# Altium project Power Distribution Board.PrjPcb
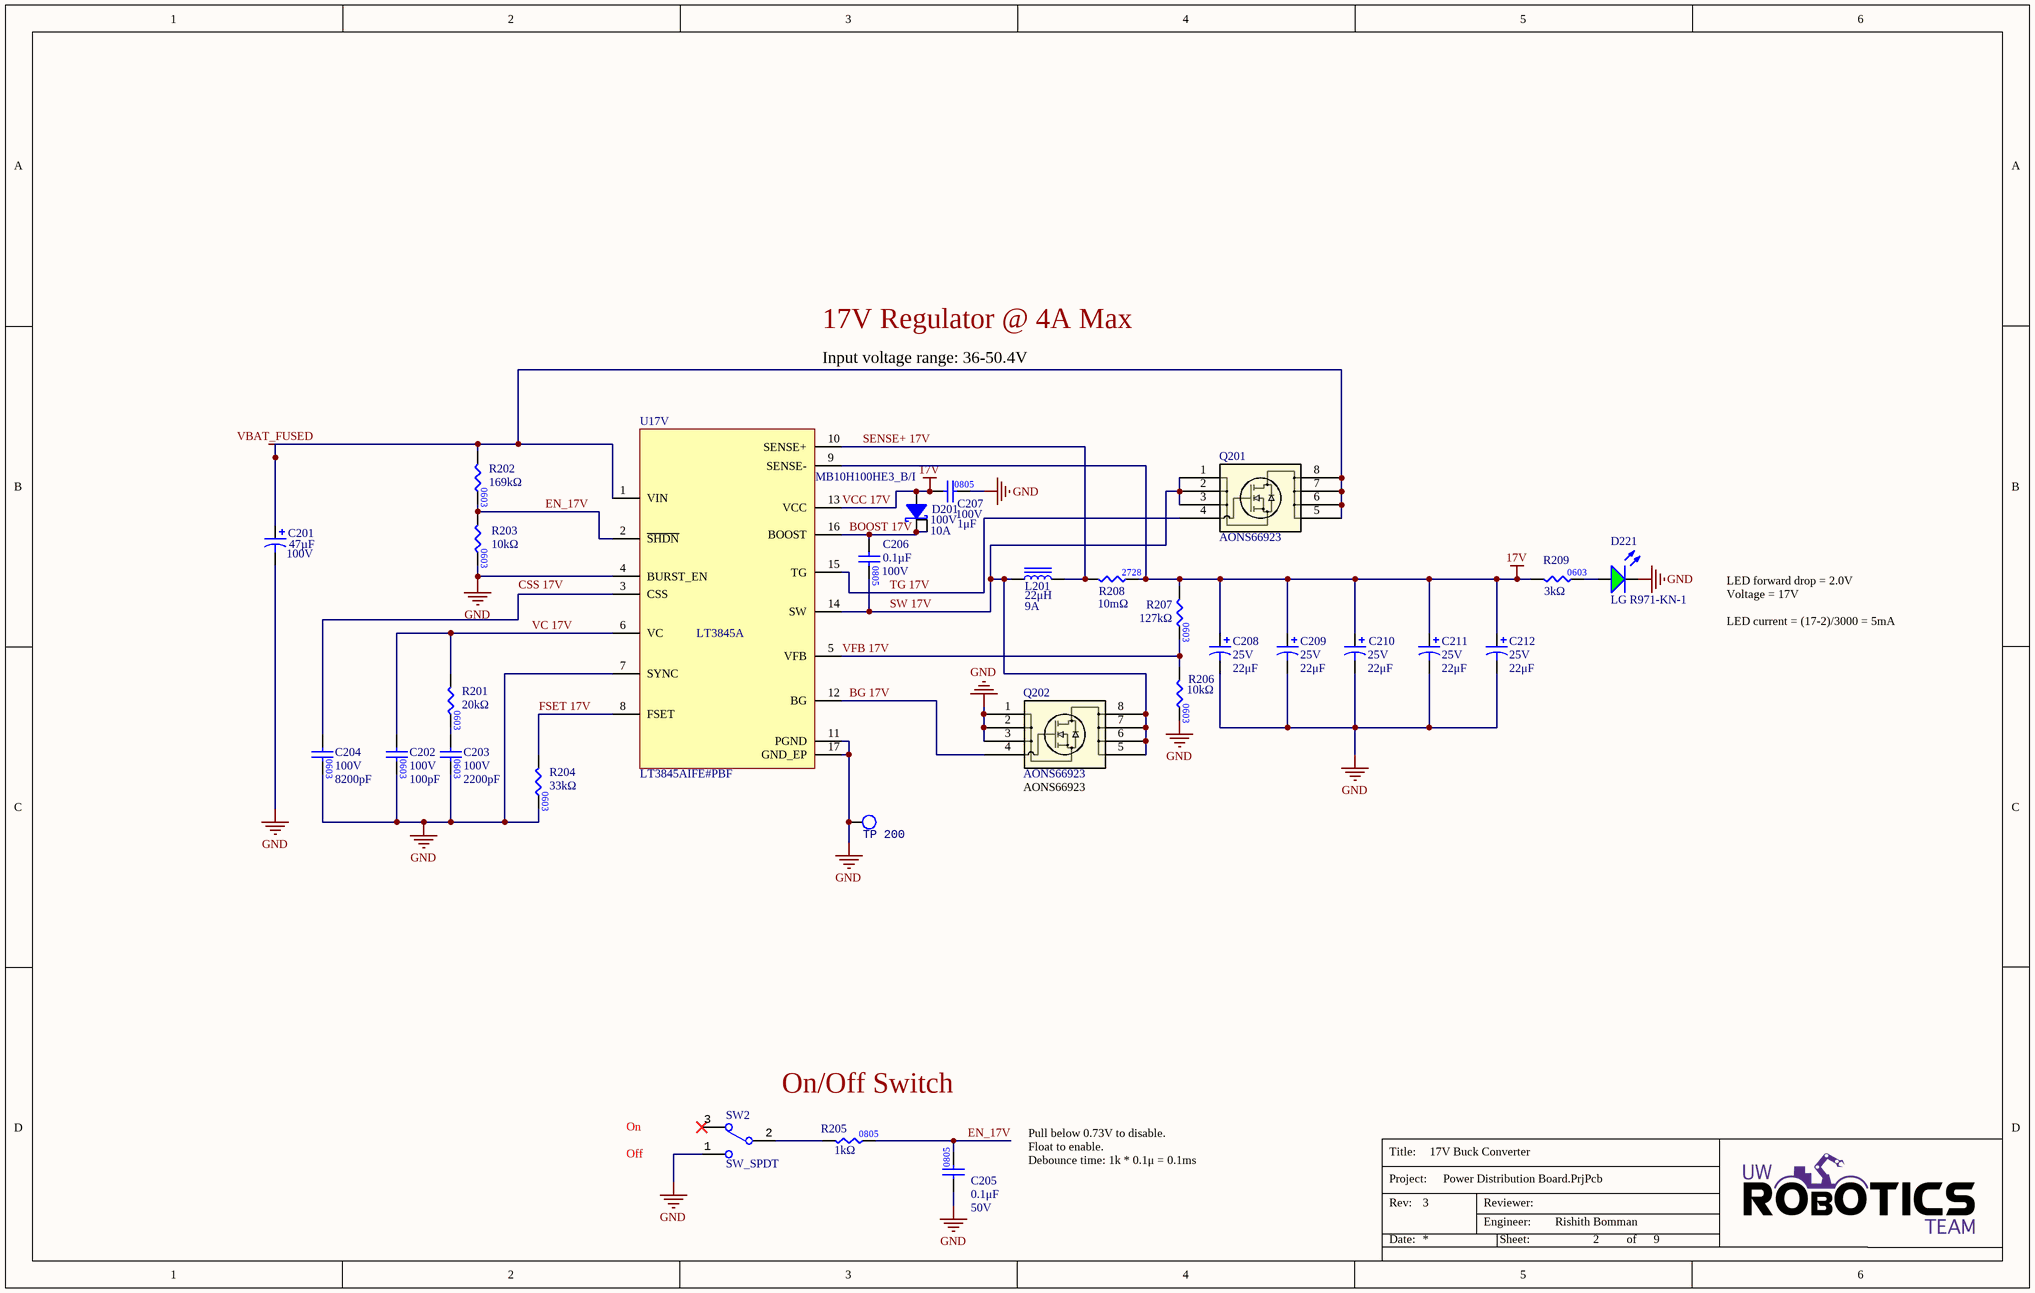
[diagram p0: SH2 - 17V BUCK CONVERTER.SchDoc]
3 sheets, 81 parts. Net scope: flat (ports and power ports of the same name join across sheets).
Board file: Power Distribution Board.PcbDoc
Sheets:
  SH2 - 17V BUCK CONVERTER.SchDoc
  SH7 - MICROCONTROLLER.SchDoc
  SH9 - RS-485.SchDoc

## Sheet SH2 - 17V BUCK CONVERTER.SchDoc: 17V Buck Converter
size B; Engineer: Rishith Bomman; Organization: UW Robotics; Address1: 200 University Avenue; Address2: Waterloo; Address3: Ontario; Address4: Canada N2L 3G6; DocumentNumber: 2; Revision: 3; SheetNumber: 2; SheetTotal: 9

### Parts
C201  value 47µF  Voltage Rating: 100V  [CAP_UCD_10X10_NCH-M]  (hidden comment: CAP_47uF_100V_ALUM_1)
C202  value 100pF  Voltage Rating: 100V  [CAP0603]  (hidden comment: CAP_100pF_100V_0603)
C203  value 2200pF  Voltage Rating: 100V  [CAP0603]  (hidden comment: CAP_2200pF_100V_0603)
C204  value 8200pF  Voltage Rating: 100V  [CAP0603]  (hidden comment: CAP_8200pF_100V_0603)
C205  value 0.1μF  Voltage Rating: 50V  [CAP2012]  (hidden comment: CAP_0.1uF_50V_0805)
C206  value 0.1µF  Voltage Rating: 100V  [CAP0805]  (hidden comment: CAP_0.1uF_100V_0805)
C207  value 1μF  Voltage Rating: 100V  [CAP2012]  (hidden comment: CAP_1uF_100V_0805)
C208  value 22μF  Voltage Rating: 25V  [CAP2917]  (hidden comment: CAP_22uF_25V_TANT)
C209  value 22μF  Voltage Rating: 25V  [CAP2917]  (hidden comment: CAP_22uF_25V_TANT)
C210  value 22μF  Voltage Rating: 25V  [CAP2917]  (hidden comment: CAP_22uF_25V_TANT)
C211  value 22μF  Voltage Rating: 25V  [CAP2917]  (hidden comment: CAP_22uF_25V_TANT)
C212  value 22μF  Voltage Rating: 25V  [CAP2917]  (hidden comment: CAP_22uF_25V_TANT)
D201  Forward Current: 10A  Manufacturer Part Number 1: MB10H100HE3_B/I  Vr (Max): 100V  [D-PAK3]  (hidden comment: DIO_SCHOTTKY_100V_5.5A)
D221  Manufacturer Part Number 1: LG R971-KN-1  [LED_0805_GREEN]  (hidden comment: LED_GREEN)
L201  Current Rating: 9A  Inductance: 22μH  [IND_BOURNS_SRP1265]  (hidden comment: IND_22uH_9A)
Q201  AONS66923  [DFN5X6_8L_EP1_P_AOS-L]
Q202  AONS66923  [DFN5X6_8L_EP1_P_AOS-L]
R201  value 20kΩ  [RES0603]  (hidden comment: RES_20kΩ_0603_1%)
R202  value 169kΩ  [RES0603]  (hidden comment: RES_169kΩ_0603_1%)
R203  value 10kΩ  [RES0603]  (hidden comment: RES_10kΩ_0603_5%)
R204  value 33kΩ  [RES0603]  (hidden comment: RES_33kΩ_0603_5%)
R205  value 1kΩ  [RES0805]  (hidden comment: RES_1kΩ_0805_1%_1)
R206  value 10kΩ  [RES0603]  (hidden comment: RES_10kΩ_0603_5%)
R207  value 127kΩ  [RES0603]  (hidden comment: RES_127kΩ_0603_1%)
R208  value 10mΩ  [STAC-CSS2725-099H_V]  (hidden comment: RES_10mΩ_2728_1%)
R209  value 3kΩ  [RES0603]  (hidden comment: RES_3kΩ_0603_1%)
SW2  SW_SPDT  [100SP1T1B4M2QE]
TP_200  TESTPOINT_LOOP  [TESTPOINT_LOOP]  (value not drawn)
U17V  BUCK_LT3845A  [LT3845AIFE#PBF]  (value not drawn)

### Nets
GND: C201.2 C202.2 C203.2 C204.2 C205.1 C207.2 C208.2 C209.2 C210.2 C211.2 C212.2 D221.2(K) Q202.1 Q202.2 Q202.3 R203.2 R204.2 R206.2 SW2.1 TP_200.1 U17V.4(BURST_EN) U17V.7(SYNC) U17V.11(PGND) U17V.17(GND_EP)
VBAT_FUSED: C201.1 Q201.5 Q201.6 Q201.7 Q201.8 R202.1 U17V.1(VIN)
VCC 17V: C207.1 C208.1 C209.1 C210.1 C211.1 C212.1 D201.2(Anode) R207.1 R208.2 R209.1 U17V.9(SENSE-) U17V.13(VCC)  [also labelled 17V]
BG 17V: Q202.4 U17V.12(BG)
BOOST 17V: C206.1 D201.1(Cathode) D201.3(Heatsink_(K)) U17V.16(BOOST)
EN_17V: C205.2 R202.2 R203.1 R205.2 U17V.2(~{SHDN})
FSET 17V: R204.1 U17V.8(FSET)
SENSE+ 17V: L201.2 R208.1 U17V.10(SENSE+)
SW 17V: C206.2 L201.1 Q201.1 Q201.2 Q201.3 Q202.5 Q202.6 Q202.7 Q202.8 U17V.14(SW)
TG 17V: Q201.4 U17V.15(TG)
VC 17V: C202.1 R201.1 U17V.6(VC)
VFB 17V: R206.1 R207.2 U17V.5(VFB)
NetC203_1: C203.1 R201.2
NetC204_1: C204.1 U17V.3(CSS)
NetD221_1: D221.1(A) R209.2
NetR205_1: R205.1 SW2.2

Not connected (* = marked no-connect by the designer): SW2 3*

### Notes on the sheet
- Input voltage range: 36-50.4V
- 17V Regulator @ 4A Max
- LED forward drop = 2.0V
  Voltage = 17V
  LED current = (17-2)/3000 = 5mA
- On/Off Switch
- Off
- On
- Pull below 0.73V to disable.
  Float to enable.
  Debounce time: 1k * 0.1μ = 0.1ms
- Labels drawn without touching a wire or pin: CSS 17V
- Title:
- Project:
- Date:
- Rev:
- Reviewer:
- Engineer:
- Sheet:
- of
- (in symbol BUCK_LT3845A) LT3845A
- (in symbol CAP_100pF_100V_0603) 0603
- (in symbol CAP_2200pF_100V_0603) 0603
- (in symbol CAP_8200pF_100V_0603) 0603
- (in symbol RES_3kΩ_0603_1%) 0603
- (in symbol RES_10mΩ_2728_1%) 2728
- (in symbol RES_20kΩ_0603_1%) 0603
- (in symbol RES_33kΩ_0603_5%) 0603
- (in symbol RES_127kΩ_0603_1%) 0603
- (in symbol RES_169kΩ_0603_1%) 0603

### Library data of the parts
C201 = CAP_47uF_100V_ALUM_1: CAP ALUM 47UF 20% 100V SMD; Manufacturer 1: Nichicon; Manufacturer Part Number 1: UUR2A470MNL1GS; Mounting Type: SMD; Package/Footprint: SMD; Supplier 1: Digi-Key; Supplier Part Number 1: 493-9589-1-ND
C202 = CAP_100pF_100V_0603: CAP CER 100PF 100V C0G/NP0 0603; Manufacturer Part Number 1: VJ0603A101JXAAC; Manufacturer 1: Vishay Vitramon; Dielectric: C0G, NP0; Supplier 1: Arrow Electronics; Supplier Part Number 1: 06031A101FAT2A
C203 = CAP_2200pF_100V_0603: CAP CER 2200PF 100V X7R 0603; Manufacturer Part Number 1: VJ0603A101JXAAC; Manufacturer 1: Vishay Vitramon; Dielectric: C0G, NP0; Supplier 1: Arrow Electronics; Supplier Part Number 1: 0603B222K101CT
C204 = CAP_8200pF_100V_0603: CAP CER 8200PF 100V X7R 0603; Manufacturer Part Number 1: VJ0603A101JXAAC; Manufacturer 1: Vishay Vitramon; Dielectric: C0G, NP0; Supplier 1: Arrow Electronics; Supplier Part Number 1: 06031C822KAT2A
C205 = CAP_0.1uF_50V_0805: CAP CER 0.1UF 50V X7R 0805; Manufacturer Part Number 1: GCM21BR71H104KA37K; Manufacturer 1: Murata Electronics; Package/Footprint: 0805; Supplier Part Number 1: 490-8049-1-ND; Supplier 1: Digi-Key; Dielectric: X7R; LCSC Part #: C49678; Mounting Type: SMD
C206 = CAP_0.1uF_100V_0805: CAP CER 0.1UF 100V X7R 0805; Manufacturer 1: TDK Corporation; Manufacturer Part Number 1: C2012X7R2A104K125AA; Package: 0805; Supplier 1: Digi-Key; Supplier 2: Arrow Electronics; Supplier Part Number 1: 445-1418-1-ND; Supplier Part Number 2: CL21B104KCFNNNE
C207 = CAP_1uF_100V_0805: CAP CER 1UF 100V X7S 0805; Manufacturer Part Number 1: C0805C224K5RACTU; Manufacturer 1: KEMET; Dielectric: X7R; Mounting Type: SMD; Package: 0805; LCSC Part #: C5378; Supplier 1: Newark; Supplier Part Number 1: 79AH1080
C208-C212 = CAP_22uF_25V_TANT: CAP TANT 22UF 20% 25V 2917; Manufacturer Part Number 1: F971A106MBAHT3; Manufacturer 1: AVX Corporation; Supplier 1: Arrow Electronics; Supplier Part Number 1: TPSD226M025R0100
D201 = DIO_SCHOTTKY_100V_10A: DIODE SCHOTTKY 100V 10A TO263AB; Manufacturer 1: Vishay General Semiconductor - Diodes Division; Package/Footprint: TO-263AB; Mounting Type: SMD; Supplier 1: Digi-Key; Supplier Part Number 1: 112-MB10H100HE3_B/ICT-ND
D221 = LED_GREEN: LED GREEN DIFFUSED 0805 SMD; Manufacturer 1: OSRAM; Forward Voltage Drop: 2.2V; Package/Footprint: 0805; Mounting Type: SMD; Supplier 1: Digi-Key; Supplier Part Number 1: 475-1410-1-ND; Supplier 2: Future Electronics; Supplier Part Number 2: 1152237
L201 = IND_22uH_9A: 22UH 20%  SMD POWER CHOKE; Manufacturer 1: Bourns Inc.; Manufacturer Part Number 1: SRP1265A-220M; DC Resistance (DCR): 37mOhms; Saturation Current: 12A; Inductance Tolerance: 20%; Mounting Type: SMD; Supplier 1: Arrow Electronics; Supplier Part Number 1: SRP1265A-220M
Q201 Q202 = NMOS_100V_15/47A_1: MOSFET N-CH 100V 15A/47A 8DFN; Mfr_Name: Alpha and Omega Semiconductor; Type: DEV; Copyright: Copyright (C) 2022 Ultra Librarian. All rights reserved.; Digi-Key_Part_Number_1: 785-1815-2-ND; Digi-Key_Part_Number_2: 785-1815-1-ND; Digi-Key_Part_Number_3: 785-1815-6-ND; RefDes: RefDes; Supplier 1: Digi-Key; Supplier Part Number 1: 785-1815-1-ND; Manufacturer_Part_Number: AONS66923
R201 = RES_20kΩ_0603_1%: RES 20K OHM 1% 1/10W 0603; Manufacturer 1: Yageo; Manufacturer Part Number 1: RC0603FR-0720KL; Supplier Part Number 1: 311-20.0KHRCT-ND; Supplier 1: Digi-Key
R202 = RES_169kΩ_0603_1%: RES 169K OHM 1% 1/10W 0603; Manufacturer 1: Yageo; Manufacturer Part Number 1: RC0603FR-07165KL; Supplier 1: Arrow Electronics; Supplier Part Number 1: RMCF0603FT169K
R203 R206 = RES_10kΩ_0603_5%: RES 10K OHM 5% 1/10W 0603; Manufacturer 1: Yageo; Manufacturer Part Number 1: RC0603JR-0710KL; Supplier Part Number 1: 311-10KGRCT-ND; Supplier 1: Digi-Key; Mounting Type: SMD; Package: 0603
R204 = RES_33kΩ_0603_5%: RES 33K OHM 5% 1/10W 0603; Manufacturer 1: Yageo; Manufacturer Part Number 1: RC0603JR-0743KL; Supplier 1: Arrow Electronics; Supplier Part Number 1: CR0603-JW-333ELF
R205 = RES_1kΩ_0805_1%_1: RES 1K OHM 1% 1/8W 0805; Manufacturer 1: Yageo; Manufacturer Part Number 1: RC0805FR-071KL; Supplier Part Number 1: 311-1.00KCRCT-ND; Supplier 1: Digi-Key; LCSC Part #: C17513; Mounting Type: SMD; Package: 0805
R207 = RES_127kΩ_0603_1%: RES 127K OHM 1% 1/10W 0603; Manufacturer 1: Stackpole Electronics Inc; Manufacturer Part Number 1: RMCF0603FT249K; Supplier 1: Arrow Electronics; Supplier Part Number 1: RC0603FR-07127KL
R208 = RES_10mΩ_2728_1%: RES 10mOHM 1% 4W 2728; Manufacturer 1: Yageo; Manufacturer Part Number 1: RC0603FR-07698KL; Supplier Part Number 1: CSSH2728FT10L0DKR-ND; Supplier 1: Digi-Key
R209 = RES_3kΩ_0603_1%: RES 3K OHM 1% 1/10W 0603; Manufacturer 1: Yageo; Manufacturer Part Number 1: RC0603FR-073KL; Supplier 1: Digi-Key; Supplier Part Number 1: 311-3.00KHRCT-ND
SW2 = SW_SPDT: SWITCH TOGGLE SPDT 5A 120V; Manufacturer 1: E-Switch; Voltage Rating (DC): 28V; Package/Footprint: TH; Supplier 1: Digi-Key; Manufacturer Part Number 1: 100SP1T1B4M2QE; Throw Configuration: SPDT; Supplier Part Number 1: EG2355-ND; Current Rating: 5A; Mounting Type: TH
TP_200 = TESTPOINT_LOOP: TESTPOINT THRUHOLE; Manufacturer 1: Keystone Electronics; Manufacturer Part Number 1: 5002; Package/Footprint: TH; Supplier Part Number 1: 36-5002-ND; Supplier 1: Digi-Key; Mounting Type: TH
U17V = BUCK_LT3845A: IC REG CTRLR BUCK 16TSSOP; Manufacturer 1: Analog Devices Inc.; Package/Footprint: 16-TSSOP-EP; Mounting Type: SMD; Supplier 1: Mouser; Supplier Part Number 1: 584-LT3845AIFE#PBF; Manufacturer Part Number 1: LT3845AIFE#PBF

## Sheet SH7 - MICROCONTROLLER.SchDoc: Microcontroller
size B; Engineer: Farris Matar; Organization: UW Robotics; Address1: 200 University Avenue; Address2: Waterloo; Address3: Ontario; Address4: Canada N2L 3G6; DocumentNumber: 7; Revision: 3; SheetNumber: 7; SheetTotal: 9
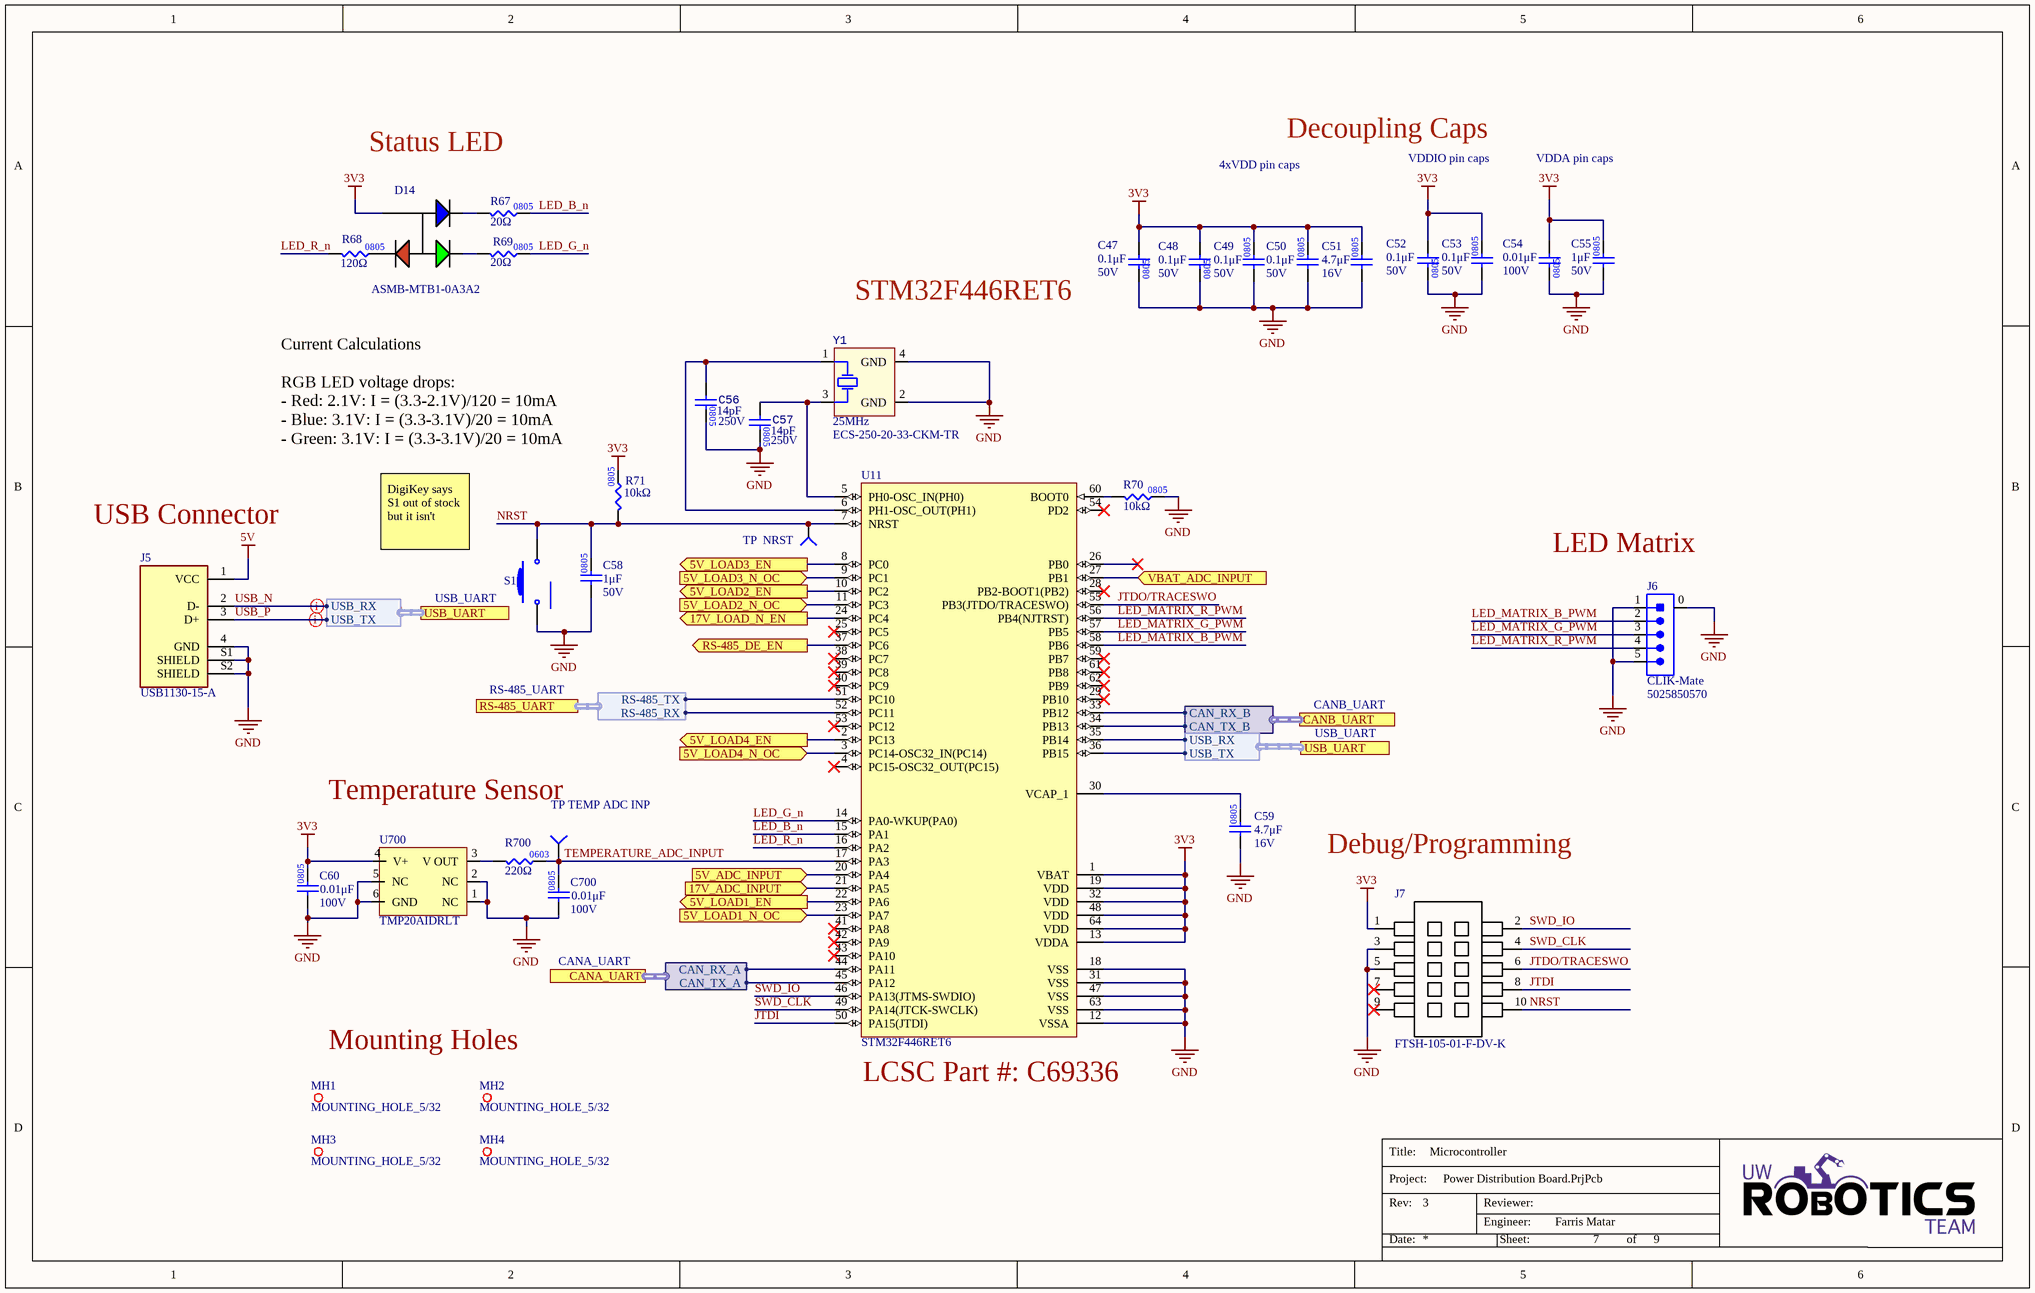
[diagram p1: SH7 - MICROCONTROLLER.SchDoc]

### Parts
C47  value 0.1μF  Voltage Rating: 50V  [CAP2012]  (hidden comment: CAP_0.1uF_50V_0805)
C48  value 0.1μF  Voltage Rating: 50V  [CAP2012]  (hidden comment: CAP_0.1uF_50V_0805)
C49  value 0.1μF  Voltage Rating: 50V  [CAP2012]  (hidden comment: CAP_0.1uF_50V_0805)
C50  value 0.1μF  Voltage Rating: 50V  [CAP2012]  (hidden comment: CAP_0.1uF_50V_0805)
C51  value 4.7μF  Voltage Rating: 16V  [CAP0805]  (hidden comment: CAP_4.7uF_16V_0805)
C52  value 0.1μF  Voltage Rating: 50V  [CAP2012]  (hidden comment: CAP_0.1uF_50V_0805)
C53  value 0.1μF  Voltage Rating: 50V  [CAP2012]  (hidden comment: CAP_0.1uF_50V_0805)
C54  value 0.01μF  Voltage Rating: 100V  [CAP0805]  (hidden comment: CAP_0.01uF_100V_0805)
C55  value 1μF  Voltage Rating: 50V  [CAP2012]  (hidden comment: CAP_1uF_50V_0805)
C56  value 14pF  Voltage Rating: 250V  [CAP0805]  (hidden comment: CAP_14pF_50V_0805)
C57  value 14pF  Voltage Rating: 250V  [CAP0805]  (hidden comment: CAP_14pF_50V_0805)
C58  value 1μF  Voltage Rating: 50V  [CAP2012]  (hidden comment: CAP_1uF_50V_0805)
C59  value 4.7μF  Voltage Rating: 16V  [CAP0805]  (hidden comment: CAP_4.7uF_16V_0805)
C60  value 0.01μF  Voltage Rating: 100V  [CAP0805]  (hidden comment: CAP_0.01uF_100V_0805)
C700  value 0.01μF  Voltage Rating: 100V  [CAP0805]  (hidden comment: CAP_0.01uF_100V_0805)
D14  Manufacturer Part Number 1: ASMB-MTB1-0A3A2  [LED_RGB]  (hidden comment: LED_RGB)
J5  Manufacturer Part Number 1: USB1130-15-A  [USB-A 2.0 Connector - 3d ver]  (hidden comment: USB-A 2.0 Connector)
J6  Family: CLIK-Mate  Manufacturer Part Number 1: 5025850570  [MOLEX-5025850570]  (hidden comment: CON_5M_SM_RA)
J7  Manufacturer Part Number 1: FTSH-105-01-F-DV-K  [FTSH-105-01-F-DV-K-P-TR]  (hidden comment: CON_PROGRAMMING)
MH1  MOUNTING_HOLE_5/32  [MOUNTING_HOLE_5/38]  (no BOM)
MH2  MOUNTING_HOLE_5/32  [MOUNTING_HOLE_5/38]  (no BOM)
MH3  MOUNTING_HOLE_5/32  [MOUNTING_HOLE_5/38]  (no BOM)
MH4  MOUNTING_HOLE_5/32  [MOUNTING_HOLE_5/38]  (no BOM)
R67  value 20Ω  [RES0805]  (hidden comment: RES_20Ω_0805_1%)
R68  value 120Ω  [RES0805]  (hidden comment: RES_120Ω_0805_1%)
R69  value 20Ω  [RES0805]  (hidden comment: RES_20Ω_0805_1%)
R70  value 10kΩ  [RES0805]  (hidden comment: RES_10kΩ_0805_5%)
R71  value 10kΩ  [RES0805]  (hidden comment: RES_10kΩ_0805_5%)
R700  value 220Ω  [RES0603]  (hidden comment: RES_220Ω_0603_5%)
S1  SW_PUSHBUTTON  [TACTILE_SWITCH_SMD]  (value not drawn)
TP_NRST  TESTPOINT_1MM_CIRCLE  [TESTPOINT_CIRCLE_1MM]  (value not drawn)  (no BOM)
TP_TEMP_ADC_INP  TESTPOINT_1MM_CIRCLE  [TESTPOINT_CIRCLE_1MM]  (value not drawn)  (no BOM)
U11  STM32F446RET6  [STM-LQFP64_L]
U700  Manufacturer Part Number 1: TMP20AIDRLT  [DRL6-M]  (hidden comment: IC_TEMP_SENSOR_Replaced)
Y1  Frequency: 25MHz  Manufacturer Part Number 1: ECS-250-20-33-CKM-TR  [XTAL_ECS-250-20-33-CKM-TR]  (hidden comment: CRYSTAL_25MHZ_20PF)

### Ports
5V_ADC_INPUT (in), 5V_LOAD1_EN (out), 5V_LOAD1_N_OC (in), 5V_LOAD2_EN (out), 5V_LOAD2_N_OC (in), 5V_LOAD3_EN (out), 5V_LOAD3_N_OC (in), 5V_LOAD4_EN (out), 5V_LOAD4_N_OC (in), 17V_ADC_INPUT (in), 17V_LOAD_N_EN (out), CANA_UART (harness CANA_UART), CANB_UART (harness CANB_UART), RS-485_DE_EN (out), RS-485_UART (harness RS-485_UART), USB_UART (harness USB_UART), VBAT_ADC_INPUT (in)

### Harnesses
CANA_UART: CAN_RX_A, CAN_TX_A
CANB_UART: CAN_RX_B, CAN_TX_B
RS-485_UART: RS-485_TX, RS-485_RX
USB_UART: USB_TX, USB_RX

### Nets
3V3: C47.2 C48.2 C49.2 C50.2 C51.2 C52.2 C53.2 C54.2 C55.2 C60.2 D14.4(COMMON_ANODE) J7.1 R71.2 U11.1(VBAT) U11.13(VDDA) U11.19(VDD) U11.32(VDD) U11.48(VDD) U11.64(VDD) U700.4(V+)
5V: J5.1(VCC)
GND: C47.1 C48.1 C49.1 C50.1 C51.1 C52.1 C53.1 C54.1 C55.1 C56.2 C57.2 C58.1 C59.1 C60.1 C700.1 J5.4(GND) J5.S1(SHIELD) J5.S2(SHIELD) J6.0 J6.1 J6.5 J7.3 J7.5 R70.2 S1.1 U11.12(VSSA) U11.18(VSS) U11.31(VSS) U11.47(VSS) U11.63(VSS) U700.1(NC) U700.2(NC) U700.5(NC) U700.6(GND) Y1.2(GND) Y1.4(GND)
JTDI: J7.8 U11.50(PA15(JTDI))
JTDO/TRACESWO: J7.6 U11.55(PB3(JTDO/TRACESWO))
LED_B_n: R67.2 U11.15(PA1)
LED_G_n: R69.2 U11.14(PA0-WKUP(PA0))
LED_MATRIX_B_PWM: J6.2 U11.58(PB6)
LED_MATRIX_G_PWM: J6.3 U11.57(PB5)
LED_MATRIX_R_PWM: J6.4 U11.56(PB4(NJTRST))
LED_R_n: R68.1 U11.16(PA2)
NRST: C58.2 J7.10 R71.1 S1.2 TP_NRST.1(=value) U11.7(NRST)
SWD_CLK: J7.4 U11.49(PA14(JTCK-SWCLK))
SWD_IO: J7.2 U11.46(PA13(JTMS-SWDIO))
TEMPERATURE_ADC_INPUT: C700.2 R700.2 TP_TEMP_ADC_INP.1(=value) U11.17(PA3)
USB_N: J5.2(D-) U11.35(PB14) ; port USB_UART.USB_RX
USB_P: J5.3(D+) U11.36(PB15) ; port USB_UART.USB_TX
NetC56_1: C56.1 U11.6(PH1-OSC_OUT(PH1)) Y1.1(HOT)
NetC57_1: C57.1 U11.5(PH0-OSC_IN(PH0)) Y1.3(HOT)
NetC59_2: C59.2 U11.30(VCAP_1)
NetD14_1: D14.1(CATHODE_(RED)) R68.2
NetD14_2: D14.2(CATHODE_(GREEN)) R69.1
NetD14_3: D14.3(CATHODE_(BLUE)) R67.1
NetR70_1: R70.1 U11.60(BOOT0)
NetR700_1: R700.1 U700.3(V_OUT)
NetTP13_1: U11.52(PC11) ; port RS-485_UART.RS-485_RX
NetTP14_1: U11.51(PC10) ; port RS-485_UART.RS-485_TX
NetTP_RS-485_EN_1: U11.37(PC6) ; port RS-485_DE_EN
NetU11_2: U11.2(PC13) ; port 5V_LOAD4_EN
NetU11_3: U11.3(PC14-OSC32_IN(PC14)) ; port 5V_LOAD4_N_OC
NetU11_8: U11.8(PC0) ; port 5V_LOAD3_EN
NetU11_9: U11.9(PC1) ; port 5V_LOAD3_N_OC
NetU11_10: U11.10(PC2) ; port 5V_LOAD2_EN
NetU11_11: U11.11(PC3) ; port 5V_LOAD2_N_OC
NetU11_20: U11.20(PA4) ; port 5V_ADC_INPUT
NetU11_21: U11.21(PA5) ; port 17V_ADC_INPUT
NetU11_22: U11.22(PA6) ; port 5V_LOAD1_EN
NetU11_23: U11.23(PA7) ; port 5V_LOAD1_N_OC
NetU11_24: U11.24(PC4) ; port 17V_LOAD_N_EN
NetU11_27: U11.27(PB1) ; port VBAT_ADC_INPUT
NetU11_33: U11.33(PB12) ; port CANB_UART.CAN_RX_B
NetU11_34: U11.34(PB13) ; port CANB_UART.CAN_TX_B
NetU11_44: U11.44(PA11) ; port CANA_UART.CAN_RX_A
NetU11_45: U11.45(PA12) ; port CANA_UART.CAN_TX_A

Not connected (* = marked no-connect by the designer): J7 7* 9*; U11 4(PC15-OSC32_OUT(PC15))* 25(PC5)* 26(PB0)* 28(PB2-BOOT1(PB2))* 29(PB10)* 38(PC7)* 39(PC8)* 40(PC9)* 41(PA8)* 42(PA9)* 43(PA10)* 53(PC12)* 54(PD2)* 59(PB7)* 61(PB8)* 62(PB9)*

### Layout directives
differential pair: USB_N, USB_P

### Notes on the sheet
- Status LED
- 4xVDD pin caps
- Decoupling Caps
- VDDIO pin caps
- VDDA pin caps
- STM32F446RET6
- (near R71) Current Calculations
  RGB LED voltage drops:
  - Red: 2.1V: I = (3.3-2.1V)/120 = 10mA
  - Blue: 3.1V: I = (3.3-3.1V)/20 = 10mA
  - Green: 3.1V: I = (3.3-3.1V)/20 = 10mA
- (near J5) USB Connector
- DigiKey says S1 out of stock but it isn't
- (near J6) LED Matrix
- Temperature Sensor
- Debug/Programming
- Mounting Holes
- (near U11) LCSC Part #: C69336
- Title:
- Project:
- Date:
- Rev:
- Reviewer:
- Engineer:
- Sheet:
- of

### Library data of the parts
C47-C50 C52 C53 = CAP_0.1uF_50V_0805: as C205 on sheet SH2 - 17V BUCK CONVERTER; Supplier Part Number 1: 490-8049-1-ND; Supplier 1: Digi-Key; Dielectric: X7R; LCSC Part #: C49678; Mounting Type: SMD
C51 C59 = CAP_4.7uF_16V_0805: CAP CER 4.7UF 16V X5R 0805; Manufacturer Part Number 1: CL21A475KOFNNNE; Manufacturer 1: Samsung Electro-Mechanics; Supplier Part Number 1: 1276-1065-1-ND; Supplier 1: Digi-Key; Dielectric: X5R; LCSC Part #: C1779; Mounting Type: SMD; Package: 0805
C54 C60 C700 = CAP_0.01uF_100V_0805: CAP CER 0.01uF 100V X7R 0805; Manufacturer Part Number 1: 08051C103KAT2A; Manufacturer 1: AVX Corporation; Supplier Part Number 1: 478-1358-1-ND; Supplier 1: Digi-Key; Dielectric: X7R; LCSC Part #: C1710; Mounting Type: SMD; Package: 0805
C55 C58 = CAP_1uF_50V_0805: CAP CER 1UF 50V X7R 0805; Manufacturer 1: Samsung Electro-Mechanics; Manufacturer Part Number 1: CL21B105KBFNNNG; Supplier Part Number 1: 1276-6470-1-ND; Supplier 1: Digi-Key; LCSC Part #: C28323; Mounting Type: SMD; Package: 0805
C56 C57 = CAP_14pF_50V_0805: CERAMIC CAP MLCC HIGH-Q 125C; Manufacturer: Murata Electronics; Manufacturer Part Number: GQM2195C2E140JB12D; Mounting Type: SMD; Package: 0805; Supplier 1: Digi-Key; Supplier Part Number 1: 490-GQM2195C2E140JB12DCT-ND
D14 = LED_RGB: LED RGB DIFFUSED 4PLCC SMD; Manufacturer 1: Broadcom; Color: Blue,Green,Red; Lens Color: White; Viewing Angle: 115°; Lens Style: Round; Luminous Intensity: 350mcd; Dominant Wavelength: 470nm; Forward Voltage: 3.1V; Test Current: 20mA; Package/Footprint: 4-PLCC; Supplier 1: Digi-Key; Number of Pins: 4; Lens Transparency: Diffused; Supplier Part Number 1: 516-3280-1-ND; Mounting Type: SMD
J5 = USB-A 2.0 Connector: USB-A (USB TYPE-A) USB 2.0 Receptacle Connector 4 Position Through Hole, Right Angle; Manufacturer 1: GCT; Supplier 1: Digi-Key; Supplier Part Number 1: 2073-USB1130-15-ACT-ND
J6 = CON_5M_SM_RA: CONN HEADER SMD RIGHT ANGLE 1.5MM PITCH; Manufacturer 1: Molex; Current Rating: 2A; Supplier 1: Digi-Key; Supplier Part Number 1: WM14469CT-ND; Orientation: Right Angle; Mounting Type: SMD; Package/Footprint: SMD
J7 = CON_PROGRAMMING: CONN HEADER SMD 10POS 1.27MM; Manufacturer 1: Samtec; Supplier 1: Digi-Key; Pitch: 1.27mm; Supplier Part Number 1: SAM8796-ND; Mounting Type: SMD
R67 R69 = RES_20Ω_0805_1%: RES 20 OHM 1% 1/8W 0805; Manufacturer 1: Yageo; Manufacturer Part Number 1: RC0805FR-0720RL; Supplier Part Number 1: 311-20.0CRCT-ND; Supplier 1: Digi-Key; LCSC Part #: C17581; Mounting Type: SMD; Package: 0805
R68 = RES_120Ω_0805_1%: RES 120 OHM 1% 1/8W 0805; Manufacturer 1: Vishay; Manufacturer Part Number 1: CRCW0805120RFKEA; Package/Footprint: 0805; Supplier Part Number 1: 541-120CCT-ND; Supplier 1: Digi-Key; LCSC Part #: C17437; Mounting Type: SMD
R70 R71 = RES_10kΩ_0805_5%: RES 10K OHM 5% 1/8W 0805; Manufacturer 1: Panasonic Electronic Components; Manufacturer Part Number 1: ERJ-6GEYJ103V; Package/Footprint: 0805; Supplier Part Number 1: P10KACT-ND; Supplier 1: Digi-Key; LCSC Part #: C17414; Mounting Type: SMD
R700 = RES_220Ω_0603_5%: RES 220 OHM 5% 1/10W 0603; Manufacturer 1: Yageo; Manufacturer Part Number 1: AC0603JR-07220RL; Package/Footprint: 0603; Supplier Part Number 1: YAG3652CT-ND; Supplier 1: Digi-Key
S1 = SW_PUSHBUTTON: SMT 3.0 X 2.6 MM TACT SWITCH WIT; Manufacturer Part Number 1: 435151014824; Manufacturer 1: Würth Elektronik; Supplier 1: Digi-Key; Supplier Part Number 1: 732-435151014824CT-ND
TP_NRST TP_TEMP_ADC_INP = TESTPOINT_1MM_CIRCLE: TESTPOINT 1MM CIRCLE
U11 = MCU_STM32F446RET6: ARM Cortex-M4 32-bit MCU+FPU, 512 KB Flash, 128 KB Internal RAM, 50 I/Os, 64-Pin LQFP, -40 to 85 degC, Tray; I/Os (High Current): 50; Supply Voltage(Vcc) min (V): 1.7; Operating Frequency(F) (Processor speed) (MHz): 180; D/A Converter: 2; Internal RAM Size (kB): 128; FLASH Size (Prog) (kB): 512; Core: ARM Cortex-M4; ComponentLink1Description: Manufacturer URL; Package Reference: 64-Pin Low-profile Quad Flat Package, Body 10 x 10 mm, Pitch 0.5 mm; ComponentLink2URL: http://www.st.com/st-web-ui/static/active/en/resource/technical/document/datasheet/DM00141306.pdf; Packing: Tray; DatasheetVersion: Rev. 6; ComponentLink1URL: http://www.st.com/; ComponentLink2Description: Datasheet; Package Description: LQFP64; Mounting Technology: Surface Mount; Supplier Part Number 1: 497-15376-ND; Supplier 1: Digi-Key
U700 = IC_TEMP_SENSOR_Replaced: SENSOR ANALOG -55C-130C 6SOT; Manufacturer 1: Texas Instruments; Package/Footprint: SOT-563; Mounting Type: SMD; Supplier 1: Digi-Key; Supplier Part Number 1: 296-25570-1-ND
Y1 = CRYSTAL_25MHZ_20PF: CRYSTAL 25.0000MHZ 20PF SMD; Manufacturer 1: ECS Inc.; Load Capacitance: 20pF; Supplier 1: Digi-Key; Supplier Part Number 1: XC1817CT-ND; Mounting Type: SMD; Package/Footprint: SMD

## Sheet SH9 - RS-485.SchDoc: RS-485
size B; CheckedBy: Cindy Li; DrawnBy: Farris Matar; Engineer: Farris Matar; Organization: UW Robotics; Address1: 200 University Avenue; Address2: Waterloo; Address3: Ontario; Address4: Canada N2L 3G6; DocumentNumber: 9; Revision: 3; SheetNumber: 9; SheetTotal: 9
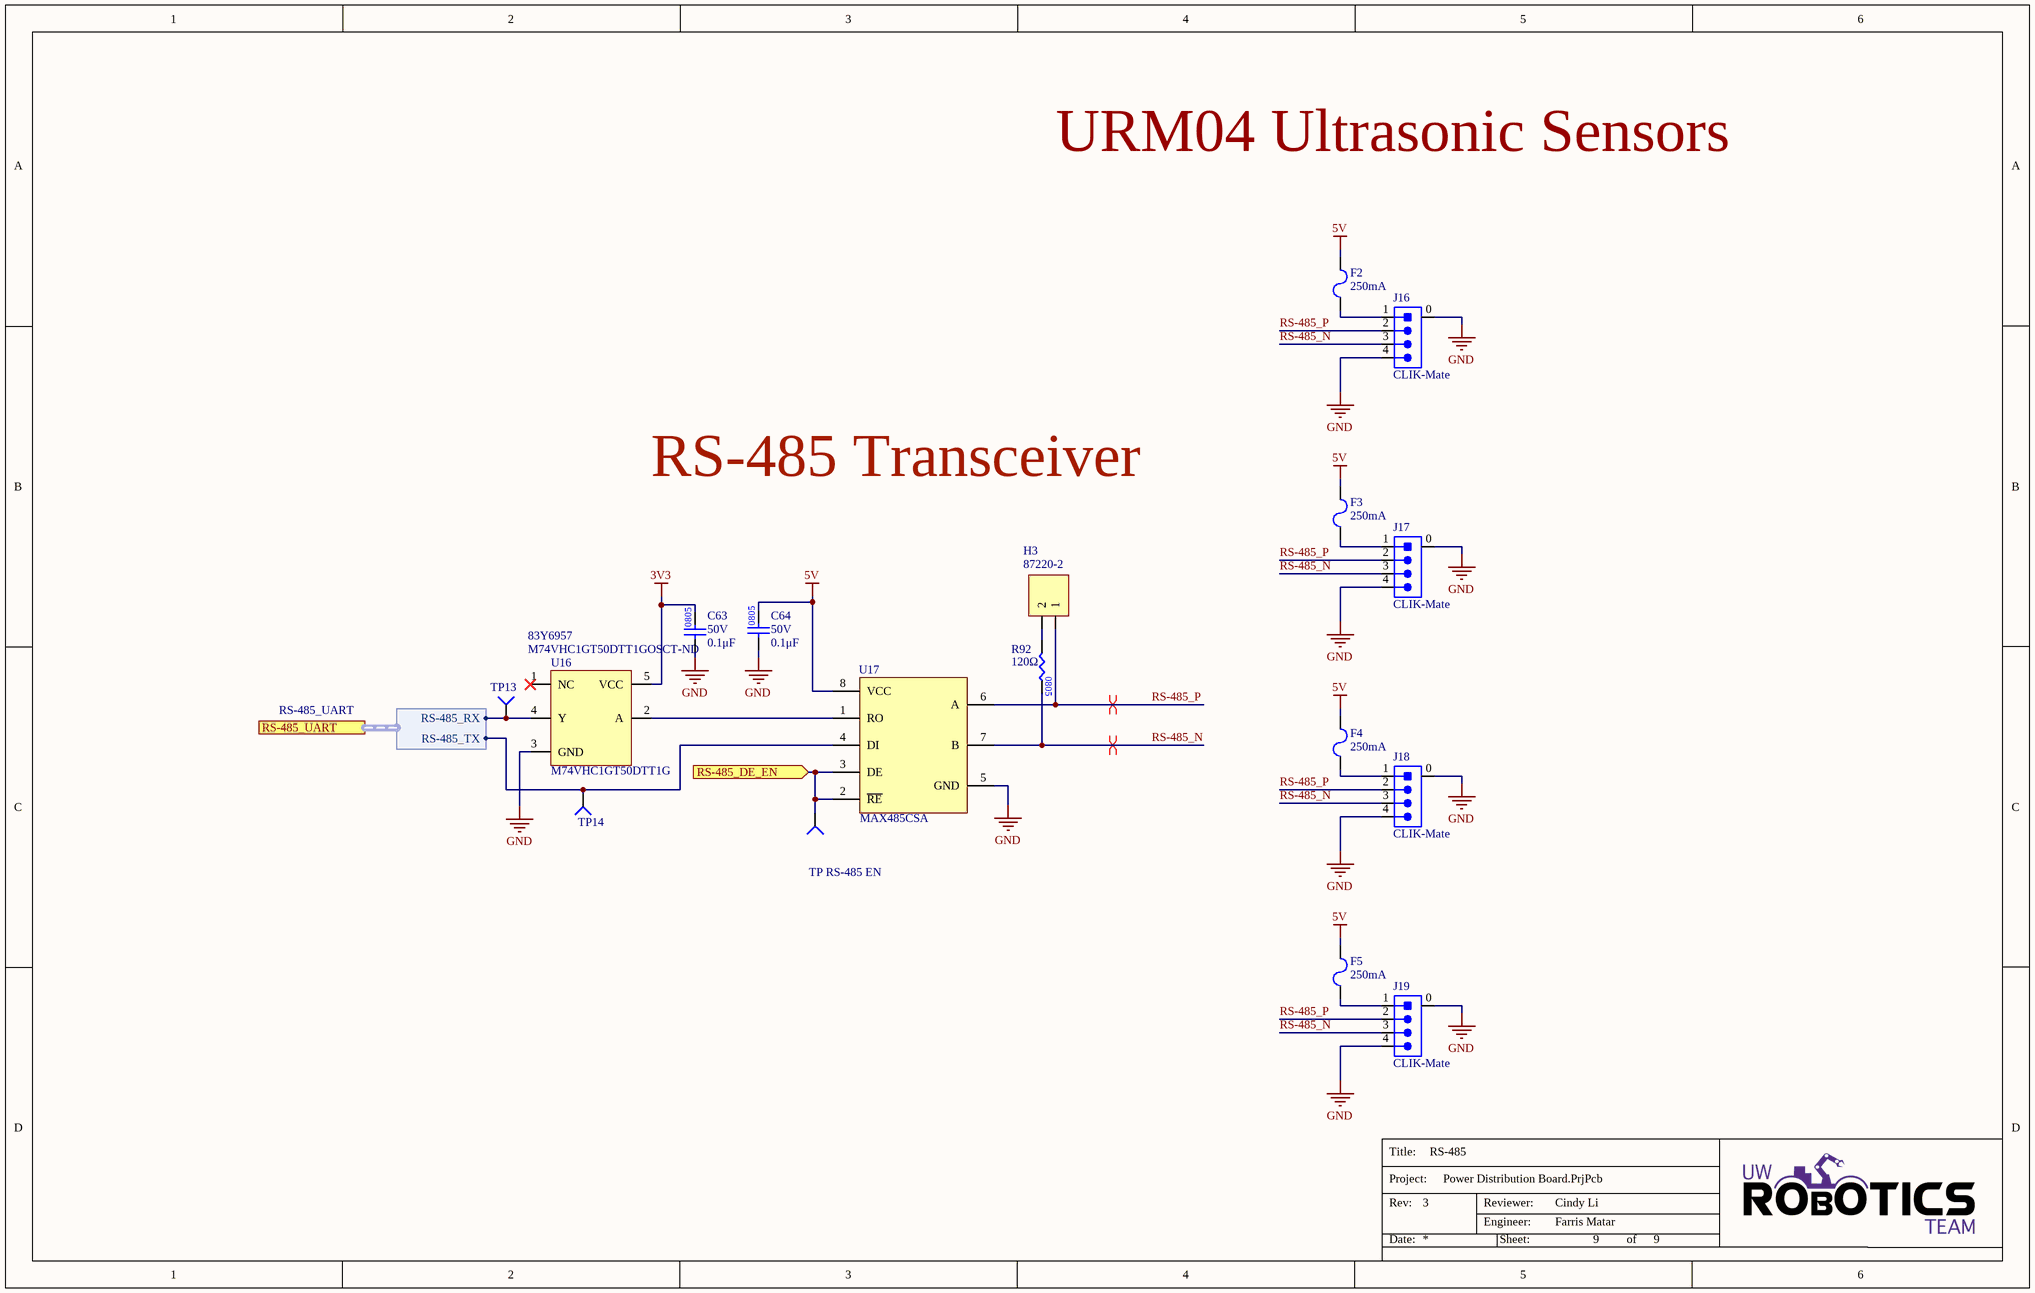
[diagram p2: SH9 - RS-485.SchDoc]

### Parts
C63  value 0.1μF  Voltage Rating: 50V  [CAP2012]  (hidden comment: CAP_0.1uF_50V_0805)
C64  value 0.1μF  Voltage Rating: 50V  [CAP2012]  (hidden comment: CAP_0.1uF_50V_0805)
F2  Current Rating: 250mA  [FUSE_1206]  (hidden comment: FUSE_250mA_1206)
F3  Current Rating: 250mA  [FUSE_1206]  (hidden comment: FUSE_250mA_1206)
F4  Current Rating: 250mA  [FUSE_1206]  (hidden comment: FUSE_250mA_1206)
F5  Current Rating: 250mA  [FUSE_1206]  (hidden comment: FUSE_250mA_1206)
H3  Manufacturer Part Number 1: 87220-2  [HDR1X2]  (hidden comment: JUMPER_2)
J16  Family: CLIK-Mate  [MOLEX-5025850470]  (hidden comment: CON_4M_SM_RA)
J17  Family: CLIK-Mate  [MOLEX-5025850470]  (hidden comment: CON_4M_SM_RA)
J18  Family: CLIK-Mate  [MOLEX-5025850470]  (hidden comment: CON_4M_SM_RA)
J19  Family: CLIK-Mate  [MOLEX-5025850470]  (hidden comment: CON_4M_SM_RA)
R92  value 120Ω  [RES0805]  (hidden comment: RES_120Ω_0805_1%)
TP13  TESTPOINT_1MM_CIRCLE  [TESTPOINT_CIRCLE_1MM]  (value not drawn)  (no BOM)
TP14  TESTPOINT_1MM_CIRCLE  [TESTPOINT_CIRCLE_1MM]  (value not drawn)  (no BOM)
TP_RS-485_EN  TESTPOINT_1MM_CIRCLE  [TESTPOINT_CIRCLE_1MM]  (value not drawn)  (no BOM)
U16  Manufacturer Part Number 1: M74VHC1GT50DTT1G  Supplier Part Number 1: M74VHC1GT50DTT1GOSCT-ND  Supplier Part Number 2: 83Y6957  [SOT23-5]  (hidden comment: IC_BUFFER)
U17  MAX485CSA  [SOIC127P600X175-8N]

### Ports
RS-485_DE_EN (in), RS-485_UART (harness RS-485_UART)

### Harnesses
RS-485_UART: RS-485_RX, RS-485_TX

### Nets
3V3: C63.2 U16.5(VCC)
5V: C64.2 F2.2 F3.2 F4.2 F5.2 U17.8(VCC)
GND: C63.1 C64.1 J16.0 J16.4 J17.0 J17.4 J18.0 J18.4 J19.0 J19.4 U16.3(GND) U17.5(GND)
RS-485_N: J16.3 J17.3 J18.3 J19.3 R92.2 U17.7(B)
RS-485_P: H3.1 J16.2 J17.2 J18.2 J19.2 U17.6(A)
NetF2_1: F2.1 J16.1
NetF3_1: F3.1 J17.1
NetF4_1: F4.1 J18.1
NetF5_1: F5.1 J19.1
NetH3_2: H3.2 R92.1
NetTP13_1: TP13.1(=value) U16.4(Y) ; port RS-485_UART.RS-485_RX
NetTP14_1: TP14.1(=value) U17.4(DI) ; port RS-485_UART.RS-485_TX
NetTP_RS-485_EN_1: TP_RS-485_EN.1(=value) U17.2(~{RE}) U17.3(DE) ; port RS-485_DE_EN
NetU16_2: U16.2(A) U17.1(RO)

Not connected (* = marked no-connect by the designer): U16 1(NC)*

### Layout directives
differential pair: RS-485_N, RS-485_P

### Notes on the sheet
- URM04 Ultrasonic Sensors
- RS-485 Transceiver
- Title:
- Project:
- Date:
- Rev:
- Reviewer:
- Engineer:
- Sheet:
- of

### Library data of the parts
C63 C64 = CAP_0.1uF_50V_0805: as C205 on sheet SH2 - 17V BUCK CONVERTER; Supplier Part Number 1: 490-8049-1-ND; Supplier 1: Digi-Key; Dielectric: X7R; LCSC Part #: C49678; Mounting Type: SMD
F2-F5 = FUSE_250mA_1206: FUSE BOARD MNT 250MA 125VAC/VDC; Manufacturer 1: Littelfuse; Manufacturer Part Number 1: 0466.250NR; Package/Footprint: 1206; Supplier 1: Digi-Key; Supplier Part Number 1: F1452CT-ND; Mounting Type: SMD
H3 = JUMPER_2: HEADER 2X1; Manufacturer 1: TE Connectivity; Package/Footprint: TH; Supplier 1: Digi-Key; Supplier Part Number 1: A26542-ND; Mount: Through Hole; Mounting Type: TH
J16-J19 = CON_4M_SM_RA: CONN HEADER SMD RIGHT ANGLE 1.5 MM PITCH; Supplier 1: Digi-Key; Supplier Part Number 1: WM9449CT-ND; Package/Footprint: SMD; Mounting Type: SMD
R92 = RES_120Ω_0805_1%: as R68 on sheet SH7 - MICROCONTROLLER; Supplier Part Number 1: 541-120CCT-ND; Supplier 1: Digi-Key; LCSC Part #: C17437; Mounting Type: SMD
TP13 TP14 TP_RS-485_EN = TESTPOINT_1MM_CIRCLE: TESTPOINT 1MM CIRCLE
U16 = IC_BUFFER: IC BUFFER NON-INVERT 5.5V 5TSOP; Manufacturer 1: onsemi; Package/Footprint: TSOP-5; Mounting Type: SMD; Supplier 1: Digi-Key; Supplier 2: Newark
U17 = MAX485CSA: IC RS485 TRANSCEIVER HALF 1/1 8SOIC; Manufacturer 1: Maxim Integrated; Manufacturer Part Number 1: MAX485CSA+T; Protocol: RS422, RS485; Data Rate: 2.5Mbps; Supply Voltage: 4.75V - 5.25V; Package/Footprint: 8-SOIC; Supplier 1: Digi-Key; Supplier Part Number 1: MAX485CSA+TCT-ND; Mounting Type: SMD; LCSC Part #: C9945

## Nets that join several sheets
3V3: SH7 - MICROCONTROLLER (20 pins), SH9 - RS-485 (C63.2 U16.5)
5V: SH7 - MICROCONTROLLER (J5.1), SH9 - RS-485 (6 pins)
GND: SH2 - 17V BUCK CONVERTER (24 pins), SH7 - MICROCONTROLLER (36 pins), SH9 - RS-485 (12 pins)
NetTP13_1: SH7 - MICROCONTROLLER (U11.52), SH9 - RS-485 (TP13.1 U16.4)
NetTP14_1: SH7 - MICROCONTROLLER (U11.51), SH9 - RS-485 (TP14.1 U17.4)
NetTP_RS-485_EN_1: SH7 - MICROCONTROLLER (U11.37), SH9 - RS-485 (TP_RS-485_EN.1 U17.2 U17.3)

## Assembly variants
Only Populated Components: not fitted R28 R31 R44 R47 R60 R77